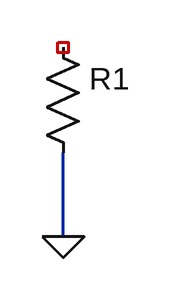
[diagram p0: schematic 25 - Hidden Window.asc]
25 - Hidden Window.asc, the LTspice schematic file:
Version 4.1
SHEET 1 880 1424
WIRE -1232 1120 -1232 1056
FLAG -1232 1120 0
SYMBOL res -1248 960 R0
WINDOW 3 36 76 Invisible 2
SYMATTR InstName R1

The netlist it stands for:
* 25 - Hidden Window.asc
R1 NC_01 0 R
.backanno
.end